# EAGLE design H-Bridge_v2 (EAGLE 7.7.0)
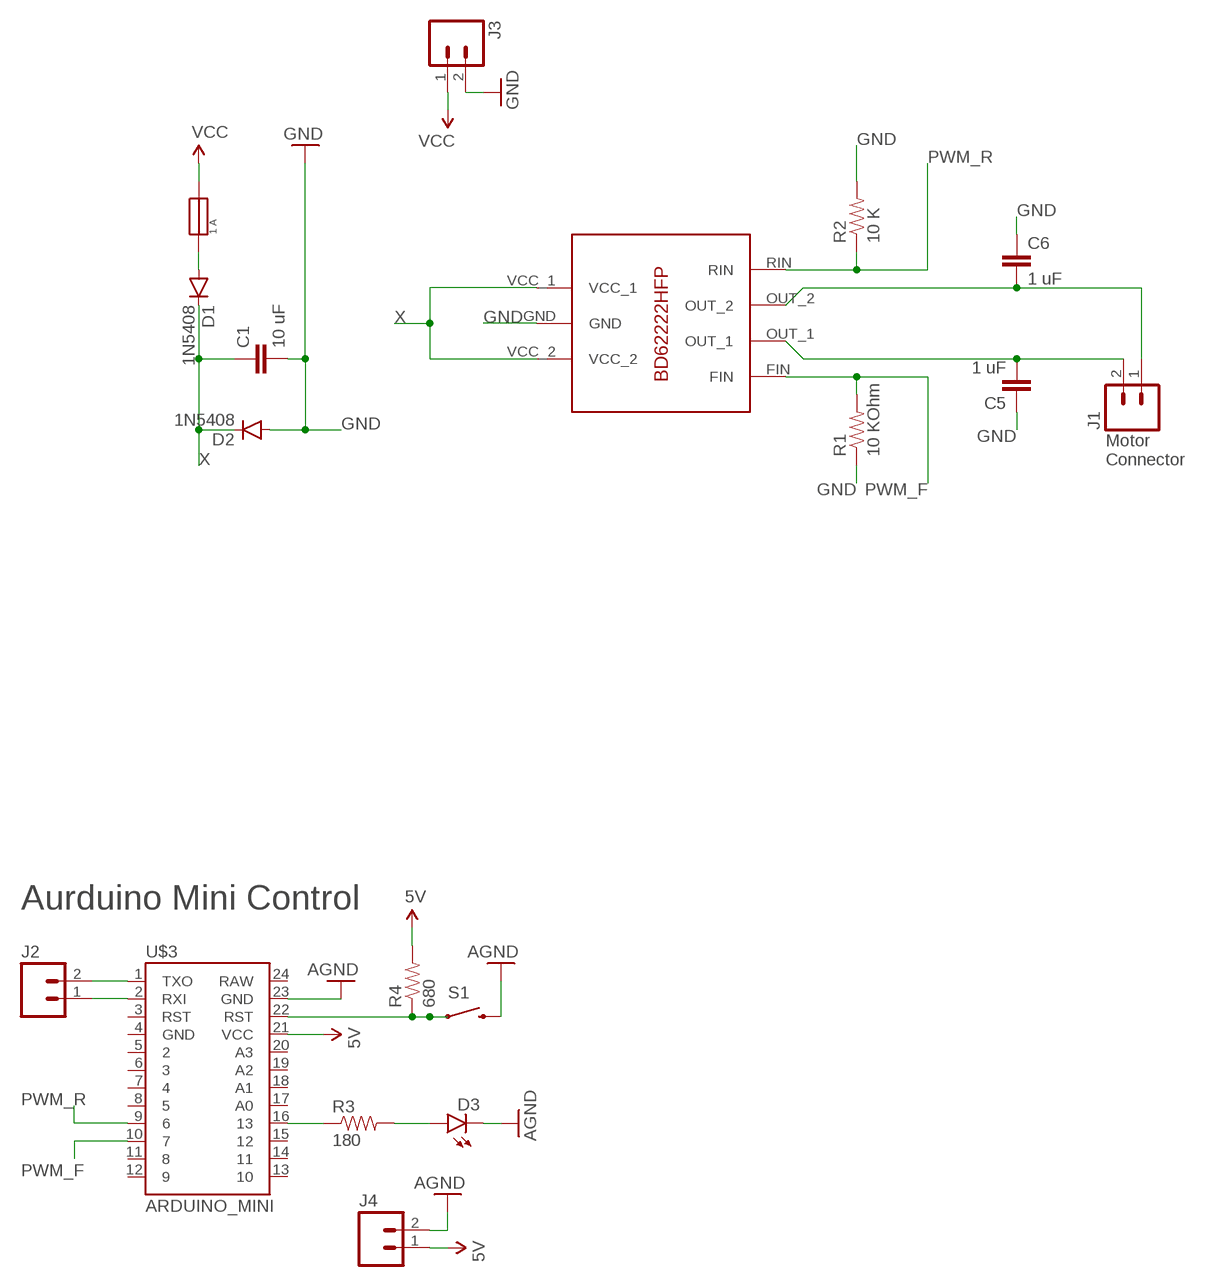
[diagram p0: schematic, sheet 1]

## Parts
C1  10 uF  CAP0805  [0805]
C5  1 uF  CAP0805  [0805]
C6  1 uF  CAP0805  [0805]
D1  1N5408  DIODE1N4148  [DIODE-1N4148]
D2  1N5408  DIODE1N4148  [DIODE-1N4148]
D3  LED3MM  [LED3MM]
J1  M023.5MM  [SCREWTERMINAL-3.5MM-2]
J2  M02LOCK  [1X02_LOCK]
J3  M023.5MM  [SCREWTERMINAL-3.5MM-2]
J4  M023.5MM  [SCREWTERMINAL-3.5MM-2]
R1  10 KOhm  RESISTORPTH-1/6W  [1/6W-RES]
R2  10 K  RESISTORPTH-1/6W  [1/6W-RES]
R3  180  RESISTORAXIAL-0.3  [AXIAL-0.3]
R4  680  RESISTORAXIAL-0.3  [AXIAL-0.3]
S1  SWITCH-MOMENTARY-2PTH  [TACTILE-PTH]
U$1  BD62222HFP  [BD62222HFP]
U$3  ARDUINO_MINI  [ARDUINO_MINI]
U$8  1 A  5MM_PC_FUSE_HOLDER_KEYSTONE_ELEC  [5MM_PC_FUSE_HOLDER_KEYSTONE_ELEC]

## Nets
5V: J4.1 R4.P$2 U$3.21(VCC)
AGND: D3.K(C) J4.2 S1.3 U$3.23(GND)
GND: C1.2 C5.1 C6.1 D2.A J3.2 R1.1 R2.2 U$1.GND
N$1: C5.2 J1.2 U$1.OUT_1
N$2: C6.2 J1.1 U$1.OUT_2
N$3: R3.P$1 U$3.16
N$4: D3.A R3.P$2
N$5: R4.P$1 S1.1 U$3.22(RST)
N$6: J2.1 U$3.2(RXI)
N$7: J2.2 U$3.1(TXO)
N$10: D1.A U$8.P$2
PWM_F: R1.2 U$1.FIN U$3.10
PWM_R: R2.1 U$1.RIN U$3.9
VCC: J3.1 U$8.P$1
X: C1.1 D1.C D2.C U$1.VCC_1 U$1.VCC_2
Unconnected: U$3.3(RST) U$3.4(GND) U$3.5 U$3.6 U$3.7 U$3.8 U$3.11 U$3.12 U$3.13 U$3.14 U$3.15 U$3.17(A0) U$3.18(A1) U$3.19(A2) U$3.20(A3) U$3.24(RAW)

## Notes on the sheet
- Motor
  Connector
- Aurduino Mini Control

## Library data of the parts
C1 = SparkFun-Passives:CAP: Capacitor Standard 0603 ceramic capacitor, and 0.1" leaded capacitor.; CAPACITANCE: 10 uF
C5 C6 = SparkFun-Passives:CAP: Capacitor Standard 0603 ceramic capacitor, and 0.1" leaded capacitor.
D1 D2 = SparkFun-DiscreteSemi:DIODE: Diode These are standard reverse protection diodes and small signal diodes. SMA package can handle up to about 1A. SOD-323 can handle about 200mA. What the SOD-323 package when ordering, there are some mfgs out there that are 5-pin packages.; PROD_ID: DIO-08378; VALUE: 1N4148
D3 = SparkFun-LED:LED: LEDs Standard schematic elements and footprints for 5mm, 3mm, 1206, and 0603 sized LEDs. 5mm - Spark Fun Electronics SKU : COM-00529 (and others); PROD_ID: DIO-08794
J1 J3 J4 = SparkFun-Connectors:M02: Standard 2-pin 0.1" header. Use with - straight break away headers ( PRT-00116) - right angle break away headers (PRT-00553) - swiss pins (PRT-00743) - machine pins (PRT-00117) - female headers (PRT-00115) Molex polarized connector foot print use with: PRT-08233 with associated crimp pins and housings. 2.54_SCREWTERM for use with PRT-10571. 3.5mm Screw Terminal footprints for PRT-08084 5mm Screw Terminal footprints for use with PRT-08432; PROD_ID: CONN-08399
J2 = SparkFun-Connectors:M02: Standard 2-pin 0.1" header. Use with - straight break away headers ( PRT-00116) - right angle break away headers (PRT-00553) - swiss pins (PRT-00743) - machine pins (PRT-00117) - female headers (PRT-00115) Molex polarized connector foot print use with: PRT-08233 with associated crimp pins and housings. 2.54_SCREWTERM for use with PRT-10571. 3.5mm Screw Terminal footprints for PRT-08084 5mm Screw Terminal footprints for use with PRT-08432
R1-R4 = SparkFun-Passives:RESISTOR: Resistor Basic schematic elements and footprints for 0603, 1206, and PTH resistors.
S1 = SparkFun-Electromechanical:SWITCH-MOMENTARY-2: Various NO switches- pushbuttons, reed, etc; PROD_ID: SWCH-08441
U$1 = BD62222HFP:BD62222HFP
U$3 = SparkFun-Boards:ARDUINO_MINI: Arduino Pro Mini footprint
U$8 = 5mm PC Fuse Holder Keystone Elec:5MM_PC_FUSE_HOLDER_KEYSTONE_ELEC

## Board
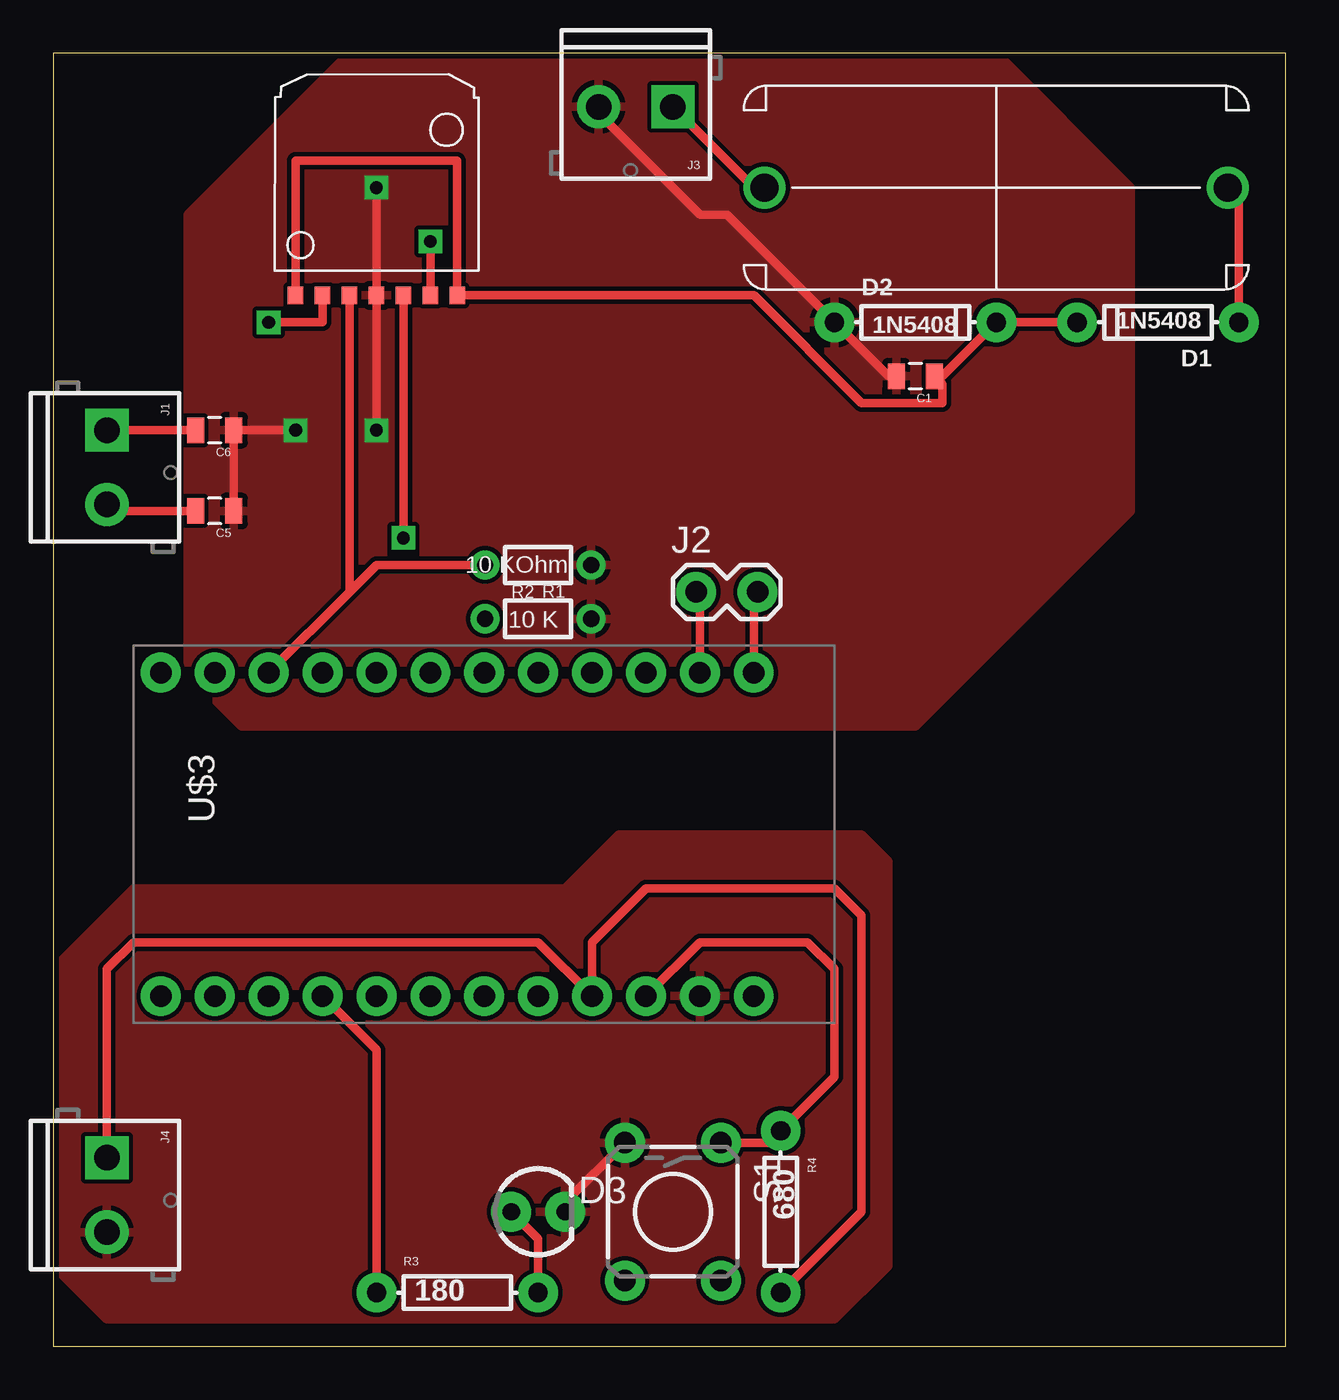
[diagram p1: board, top side]
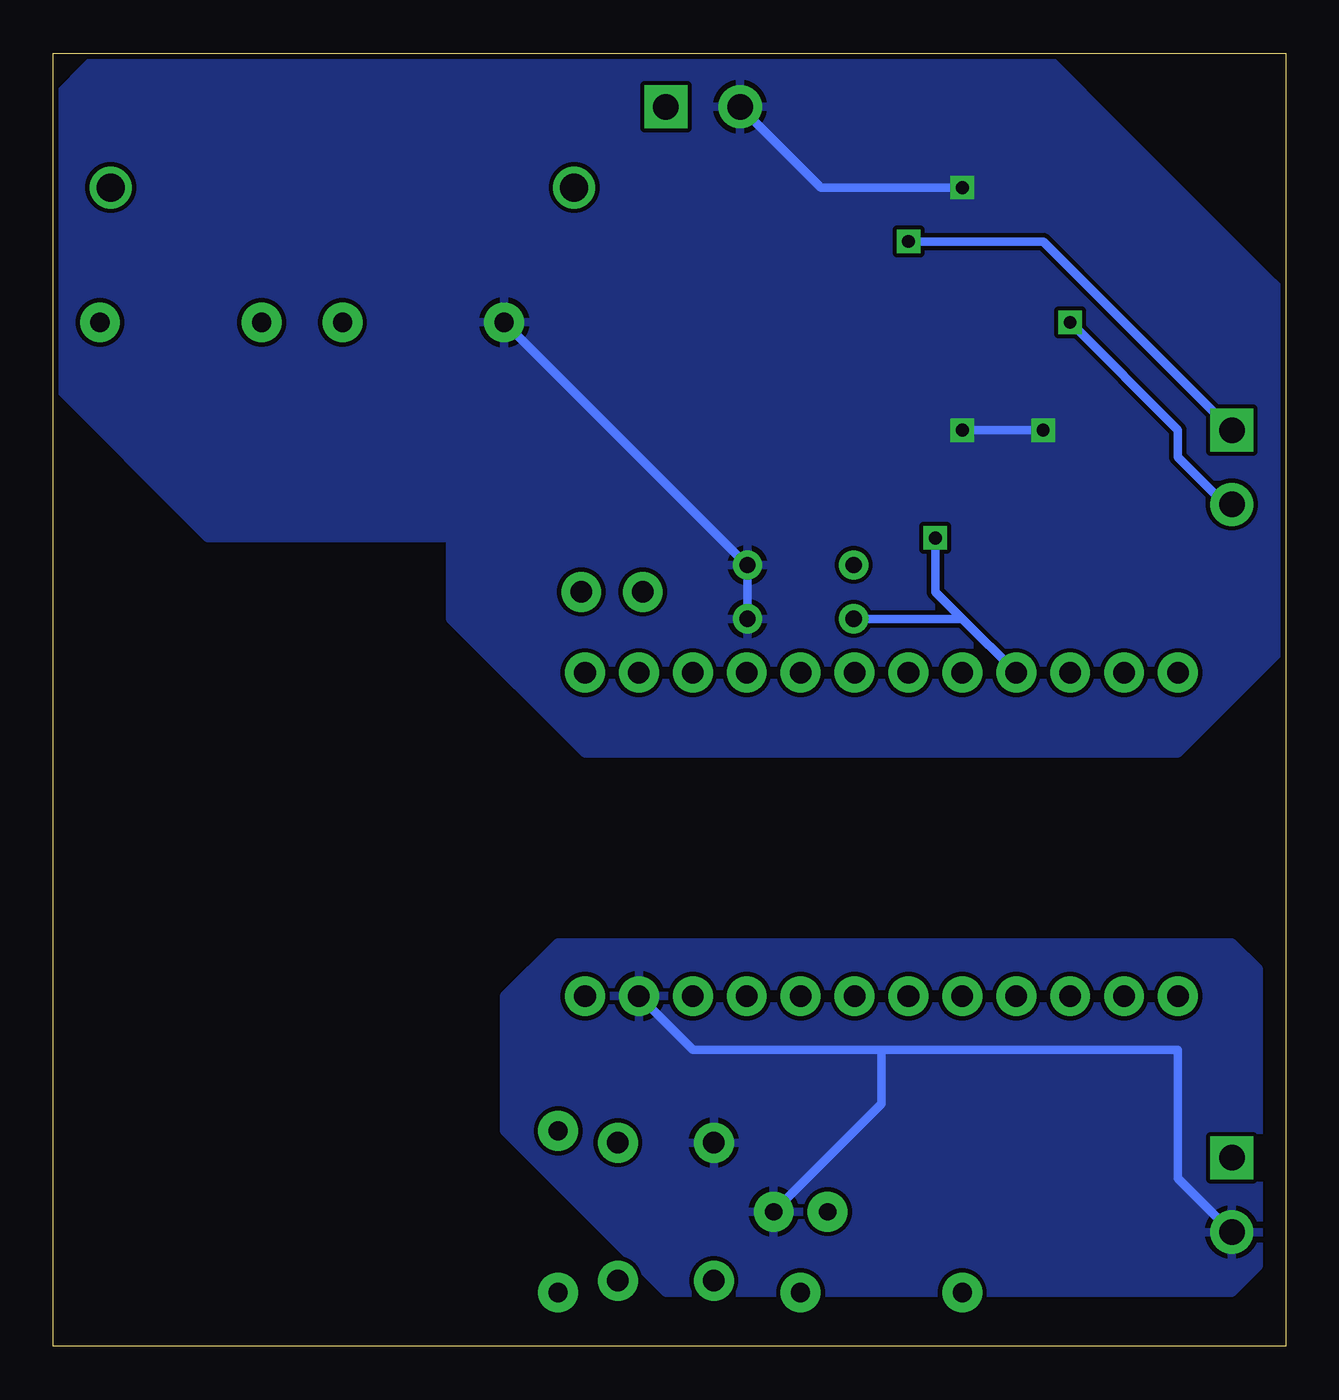
[diagram p2: board, bottom side, seen from below]

Size 58.09 x 60.95 mm. Coordinates in mm from the lower left corner, seen from the top.
Outline: 0,0 58.09,0 58.09,60.95 0,60.95 0,0
Copper layers (1*16): Top 0.035mm / dielectric 1.5mm / Bottom 0.035mm
Design rules "SparkFun": minimum track width 8mil, minimum drill 20mil, track to track 8mil, track to pad 8mil, pad to pad 8mil, via to via 8mil, smd to smd 8mil, copper to edge 10mil, drill to drill 8mil, minimum pad ring 12mil, minimum via ring 10mil, stop-mask expansion 4mil, vias tented up to drill 25mil, thermal gap 10mil

### Footprints (pad centres in the part's own frame; a part is rotated, then mirrored left to right if it is on the bottom)
0805 = smd 0.8 x 1.2: 1 -0.9,0; 2 0.9,0
DIODE-1N4148 = drill 0.9 pad 1.88: A -3.81,0; C 3.81,0
LED3MM = drill 0.813 pad 1.88: A -1.27,0; K 1.27,0
SCREWTERMINAL-3.5MM-2 = drill 1.2 pad 2.032 square: 1 0,0 | drill 1.2 pad 2.032: 2 3.5,0
1X02_LOCK = drill 1.016 pad 1.88: 1 -0.178,0; 2 2.718,0
1/6W-RES = drill 0.762: 1 -2.5,0; 2 2.5,0
AXIAL-0.3 = drill 0.9 pad 1.88: P$1 -3.81,0; P$2 3.81,0
TACTILE-PTH = drill 1.016 pad 1.88: 1 -3.251,2.261; 2 3.251,2.261; 3 -3.251,-2.261; 4 3.251,-2.261
BD62222HFP = smd 0.835 x 0.73: FIN 0,1.27; GND 0,0; OUT_1 0,2.54; OUT_2 0,-2.54; RIN 0,-1.27; VCC_1 0,3.81; VCC_2 0,-3.81
ARDUINO_MINI = drill 1.016 pad 1.88: 1 -7.62,12.7; 2 -7.62,10.16; 3 -7.62,7.62; 4 -7.62,5.08; 5 -7.62,2.54; 6 -7.62,0; 7 -7.62,-2.54; 8 -7.62,-5.08; 9 -7.62,-7.62; 10 -7.62,-10.16; 11 -7.62,-12.7; 12 -7.62,-15.24; 13 7.62,-15.24; 14 7.62,-12.7; 15 7.62,-10.16; 16 7.62,-7.62; 17 7.62,-5.08; 18 7.62,-2.54; 19 7.62,0; 20 7.62,2.54; 21 7.62,5.08; 22 7.62,7.62; 23 7.62,10.16; 24 7.62,12.7
5MM_PC_FUSE_HOLDER_KEYSTONE_ELEC = drill 1.32: P$1 10.92,0; P$2 -10.92,0

### Placement (x,y rotation side)
C1  40.64,45.72 180 top
C5  7.62,39.37 180 top
C6  7.62,43.18 180 top
D1  52.07,48.26 180 top
D2  40.64,48.26 0 top
D3  22.86,6.35 0 top
J1  2.54,43.18 270 top
J2  30.48,35.56 0 top
J3  29.21,58.42 180 top
J4  2.54,8.89 270 top
R1  22.86,36.83 180 top
R2  22.86,34.29 0 top
R3  19.05,2.54 0 top
R4  34.29,6.35 270 top
S1  29.21,6.35 270 top
U$1  15.24,49.53 90 top
U$3  20.32,24.13 270 top
U$8  44.45,54.61 180 top

### Tracks (layer width: path | path; a pad name or v marks a point on that pad's centre or on a via)
5V
  Top 0.406: J4.1 2.54,17.78 3.81,19.05 22.86,19.05 U$3.21 25.4,19.05 27.94,21.59 36.83,21.59 38.1,20.32 38.1,6.35 R4.P$2
AGND
  Top 0.406: S1.3 24.13,6.78 D3.K
  Bottom 0.406: J4.2 5.08,7.93 5.08,13.97 19.05,13.97 | 19.05,13.97 27.94,13.97 U$3.23 | D3.K 19.05,11.43 19.05,13.97
  pour Top: 0,12.7 0,17.78 3.81,21.59 24.13,21.59 26.67,24.13 38.1,24.13 39.37,22.86 39.37,3.81 36.83,1.27 2.54,1.27 1.27,2.54 0,3.81
  pour Bottom: 2.54,19.05 34.29,19.05 36.83,16.51 36.83,10.16 29.21,2.54 2.54,2.54 1.27,3.81 1.27,17.78
GND  (via drill 0.6)
  Top 0.406: C5.1 C6.1 v11.43,43.18 | C1.2 39.37,45.72 D2.A 31.75,53.34 30.48,53.34 25.71,58.11 J3.2 | v15.24,54.61 U$1.GND v15.24,43.18
  Bottom 0.406: J3.2 21.9,54.61 v15.24,54.61 | R2.2 R1.1 25.4,36.83 D2.A | v11.43,43.18 v15.24,43.18
  pour Bottom: 1.27,48.26 1.27,50.8 8.89,58.42 10.16,59.69 11.43,60.96 55.88,60.96 58.42,58.42 58.42,45.72 50.8,38.1 39.37,38.1 39.37,34.29 33.02,27.94 5.08,27.94 1.27,31.75
  pour Bottom: 1.27,50.8 0,49.53 0,33.02 1.27,31.75 2.54,31.75 3.81,31.75 11.43,39.37 11.43,49.53 10.16,50.8
  pour Top: 6.35,53.34 6.35,31.75 8.89,29.21 40.64,29.21 50.8,39.37 50.8,54.61 44.45,60.96 13.97,60.96
N$1  (via drill 0.6)
  Top 0.406: J1.2 2.85,39.37 C5.2 | U$1.OUT_1 12.7,48.26 v10.16,48.26
  Bottom 0.406: v10.16,48.26 5.08,43.18 5.08,41.91 2.85,39.68 J1.2
N$2  (via drill 0.6)
  Top 0.406: J1.1 C6.2 | v17.78,52.07 U$1.OUT_2
  Bottom 0.406: J1.1 11.43,52.07 v17.78,52.07
N$3
  Top 0.406: U$3.16 15.24,13.97 R3.P$1
N$4
  Top 0.406: D3.A 22.86,5.08 R3.P$2
N$5
  Top 0.406: U$3.22 30.48,19.05 35.56,19.05 36.83,17.78 36.83,12.7 R4.P$1 33.73,9.6 S1.1
N$6
  Top 0.406: J2.1 30.48,35.38 U$3.2
N$7
  Top 0.406: J2.2 33.02,35.38 U$3.1
N$10
  Top 0.406: U$8.P$2 55.88,54.1 D1.A
PWM_F
  Top 0.406: U$1.FIN 13.97,35.56 | 13.97,35.56 U$3.10 | R1.2 15.24,36.83 13.97,35.56
PWM_R  (via drill 0.6)
  Top 0.406: U$1.RIN v16.51,38.1
  Bottom 0.406: v16.51,38.1 16.51,35.56 15.24,34.29 | 15.24,34.29 U$3.9 | R2.1 15.24,34.29
VCC
  Top 0.406: J3.1 33.02,54.61 U$8.P$1
X
  Top 0.406: D1.C D2.C 41.91,45.72 C1.1 41.91,45.35 41.91,44.45 38.1,44.45 33.02,49.53 U$1.VCC_2 19.05,55.88 11.43,55.88 U$1.VCC_1